# Altium schematic sheet TLC4100_SMB_charger.SchDoc
size A4
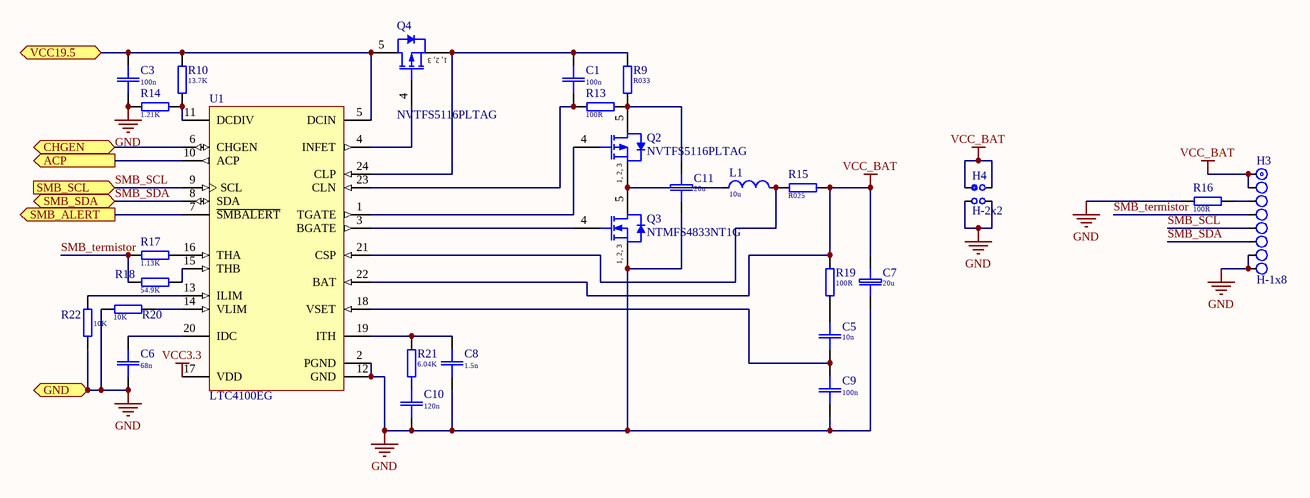
[diagram p0: TLC4100_SMB_charger.SchDoc]

## Parts
C1  100n  [C0805(2013)]
C3  100n  [C0805(2013)]
C5  10n  [C0805(2013)]
C6  68n  [C0805(2013)]
C7  20u  [EL SMD Case G D10x10.3 h10.2(1010)]
C8  1.5n  [C0805(2013)]
C9  100n  [C0805(2013)]
C10  120n  [C0805(2013)]
C11  20u  [EL SMD Case G D10x10.3 h10.2(1010)]
H3  H-1x8  [J1x8]
H4  H-2x2  [J2x2]
L1  10u  [Dr-SD-73]
Q2  NVTFS5116PLTAG  [ONSC-DFN-5-488AA_V]
Q3  NTMFS4833NT1G  [ONSC-DFN-5-488AA_V]
Q4  NVTFS5116PLTAG  [ONSC-DFN-5-488AA_V]
R9  R033  [R2512]
R10  13.7K  [R0805]
R13  100R  [R0805]
R14  1.21K  [R0805]
R15  R025  [R2512]
R16  100R  [R0805]
R17  1.13K  [R0805]
R18  54.9K  [R0805]
R19  100R  [R0805]
R20  10K  [R0805]
R21  6.04K  [R0805]
R22  10K  [R0805]
U1  LTC4100EG  [LT-G-24_N]

## Ports
ACP (out), CHGEN (bidir), GND, SMB_ALERT (out), SMB_SCL (in), SMB_SDA, VCC19.5

## Nets
GND: C3.2 C6.2 C7.2(-) C8.2 C9.2 C10.2 C11.2(-) H3.7 H3.8 H4.3 H4.4 Q3.1(S) Q3.2(S) Q3.3(S) R14.2 R16.1 R20.1 R22.1 U1.2(PGND) U1.12(GND) ; port GND
VCC3.3: U1.17(VDD)
VCC_BAT: C7.1(+) H3.1 H3.2 H4.1 H4.2 R15.1 R19.1 U1.22(BAT)
ACP: U1.10(ACP) ; port ACP
CHGEN: U1.6(CHGEN) ; port CHGEN
SMB_ALERT: U1.7(~{SMBALERT}) ; port SMB_ALERT
SMB_SCL: H3.5 U1.9(SCL) ; port SMB_SCL
SMB_SDA: H3.6 U1.8(SDA) ; port SMB_SDA
SMB_termistor: H3.4 R17.2 R18.2
VCC19.5: C3.1 Q4.5(D) R10.1 U1.5(DCIN) ; port VCC19.5
NetC1_1: C1.1 Q4.1(S) Q4.2(S) Q4.3(S) R9.2 U1.24(CLP)
NetC1_2: C1.2 R13.2 U1.23(CLN)
NetC5_1: C5.1 R19.2
NetC5_2: C5.2 C9.1 U1.18(VSET)
NetC6_1: C6.1 U1.20(IDC)
NetC8_1: C8.1 R21.1 U1.19(ITH)
NetC10_1: C10.1 R21.2
NetC11_1: C11.1(+) Q2.5(D) R9.1 R13.1
NetH3_3: H3.3 R16.2
NetL1_1: L1.1 Q2.1(S) Q2.2(S) Q2.3(S) Q3.5(D)
NetL1_2: L1.2 R15.2 U1.21(CSP)
NetQ2_4: Q2.4(G) U1.1(TGATE)
NetQ3_4: Q3.4(G) U1.3(BGATE)
NetQ4_4: Q4.4(G) U1.4(INFET)
NetR10_2: R10.2 R14.1 U1.11(DCDIV)
NetR17_1: R17.1 U1.16(THA)
NetR18_1: R18.1 U1.15(THB)
NetR20_2: R20.2 U1.14(VLIM)
NetR22_2: R22.2 U1.13(ILIM)

## Notes on the sheet
- (in symbol NTMFS4833NT1G) 1, 2, 3
- (in symbol NVTFS5116PLTAG) 1, 2, 3

## Library data of the parts
C1 C3 C5 C6 C8-C10 = C-0805  100V 10n: SMD-0805 100V X7R 10%; Price: 0.062
  C1 C3 C9: Value: 100n
  C5: Value: 10n
  C6: Value: 68n
  C8: Value: 1.5n
  C10: Value: 120n
C7 C11 = EL 100u/35V: EL 35V SMD Case G D10x10.3h10.5; Price: 0.014; Value: 20u
L1 = L-SD-73 10uH: 2.1A 0.08om 7x7x3.2mm; Price: 0.85; Value: 10u
Q2 Q4 = NVTFS5116PLTAG: Power MOSFET, -60 V, -14 A, 52 mOhm, Single P-Channel, 8-Pin WDFN, Pb-Free, Tape and Reel; Manufacturer: On Semiconductor; Channel Polarity: P Channel; Ciss Typ (pF): 1258; Coss Typ (pF): 127; Crss Typ (pF): 84; ID Max (A): 14; Qrr Typ (nC): 24; V(BR)DSS Min (V): 60; VGS Max (V): 20; VGS(th) Max (V): 3; DatasheetVersion: Rev. 2; PackageVersion: Rev. D, 04/2012; PackageReference: WDFN-8-511AB; PackageDescription: 8-Pin Small Outline No-Lead, Body 3.05 x 3.05 mm, Pitch 0.65 mm; Supplier 1: Digi-Key; Supplier Part Number 1: NVTFS5116PLTAG-ND; Supplier 2: Newark; Supplier Part Number 2: 65T1524; Supplier 3: Newark; Supplier Part Number 3: 95W2776; Supplier 4: Mouser; Supplier Part Number 4: 863-NVTFS5116PLTAG; Configuration: Single; Package Type: u8FL / WDFN-8; Packing: Tape and Reel; RoHS: Pb-Free; Mounting Technology: Surface Mount; PartNumber: NVTFS5116PLTAG; ComponentLink1Description: Manufacturer URL; ComponentLink1URL: http://www.onsemi.com/; ComponentLink2Description: Datasheet; ComponentLink2URL: http://www.onsemi.com/pub_link/Collateral/NVTFS5116PL-D.PDF; ComponentLink3Description: Package Specification; ComponentLink3URL: http://www.onsemi.com/pub_link/Collateral/511AB.PDF
Q3 = NTMFS4833NT1G: Power MOSFET, 30 V, 191 A, Single N-Channel, 5-Pin DFN, Pb-Free, Tape and Reel; Manufacturer: On Semiconductor; Channel Polarity: N Channel; Ciss Typ (pF): 5600; Coss Typ (pF): 1200; Crss Typ (pF): 650; ID Max (A): 191; Qrr Typ (nC): 36; V(BR)DSS Min (V): 30; VGS Max (V): 20; VGS(th) Max (V): 2.5; DatasheetVersion: Rev. 9; PackageVersion: Rev. H, 03/2013; PackageReference: DFN-5-488AA; PackageDescription: 5-Pin Small Outline No-Lead, Body 4.9 x 5.9 mm, Pitch 1.27 mm; Configuration: Single; Package Type: SO-8FL / DFN-5; Packing: Tape and Reel; RoHS: Pb-Free; Mounting Technology: Surface Mount; Code_JEDEC: MO-240A; PartNumber: NTMFS4833NT1G; ComponentLink1Description: Manufacturer URL; ComponentLink1URL: http://www.onsemi.com/; ComponentLink2Description: Datasheet; ComponentLink2URL: http://www.onsemi.com/pub_link/Collateral/NTMFS4833N.PDF; ComponentLink3Description: Package Specification; ComponentLink3URL: http://www.onsemi.com/pub_link/Collateral/488AA.PDF
R9 R10 R13-R22 = R-0805: SMD 0805 0.1W 5% 150V; Price: 0.017
  R9: Value: R033
  R10: Value: 13.7K
  R13 R16 R19: Value: 100R
  R14: Value: 1.21K
  R15: Value: R025
  R17: Value: 1.13K
  R18: Value: 54.9K
  R20 R22: Value: 10K
  R21: Value: 6.04K
U1 = LTC4100EG: Smart Battery Charger Controller, 6 to 28 V Vin, 24-pin SOP (G-24), -40 to 85 degC; Manufacturer: Linear Technology; Battery Chemistry: Li-Ion, Li-Polymer, NiCd, NiMH; Charge Termination: On-board timer, Microcontroller; Float Voltage: Adj; Max Charge Current(A): 4; Number of Cells: 2 to 6 (Li); Type of Charger: Switching, SMBus; Vin Max(V): 28; Vin Min(V): 6; DatasheetVersion: Rev. B; PackageVersion: Jun-10; PackageReference: G-24; PackageDescription: 24-Pin Plastic SSOP, Body 8.2 x 5.3 mm, Pitch 0.65 mm; Supplier 1: Digi-Key; Supplier Part Number 1: LTC4100EG-ND; Supplier 2: Newark; Supplier Part Number 2: 58M0959; RoHS: FALSE; Mounting Technology: Surface Mount; PartNumber: LTC4100EG; ComponentLink1Description: Manufacturer URL; ComponentLink1URL: http://www.linear.com/; ComponentLink2Description: Datasheet; ComponentLink2URL: http://cds.linear.com/docs/en/datasheet/4100fb.pdf; ComponentLink3Description: Package Specification; ComponentLink3URL: http://cds.linear.com/docs/en/packaging/SSOP_24_05-08-1640.pdf
H3 = H-1x8: Price: 0.08
H4 = H-2x2: Price: 0.04